# EAGLE design 2532 (EAGLE 9.6.2)
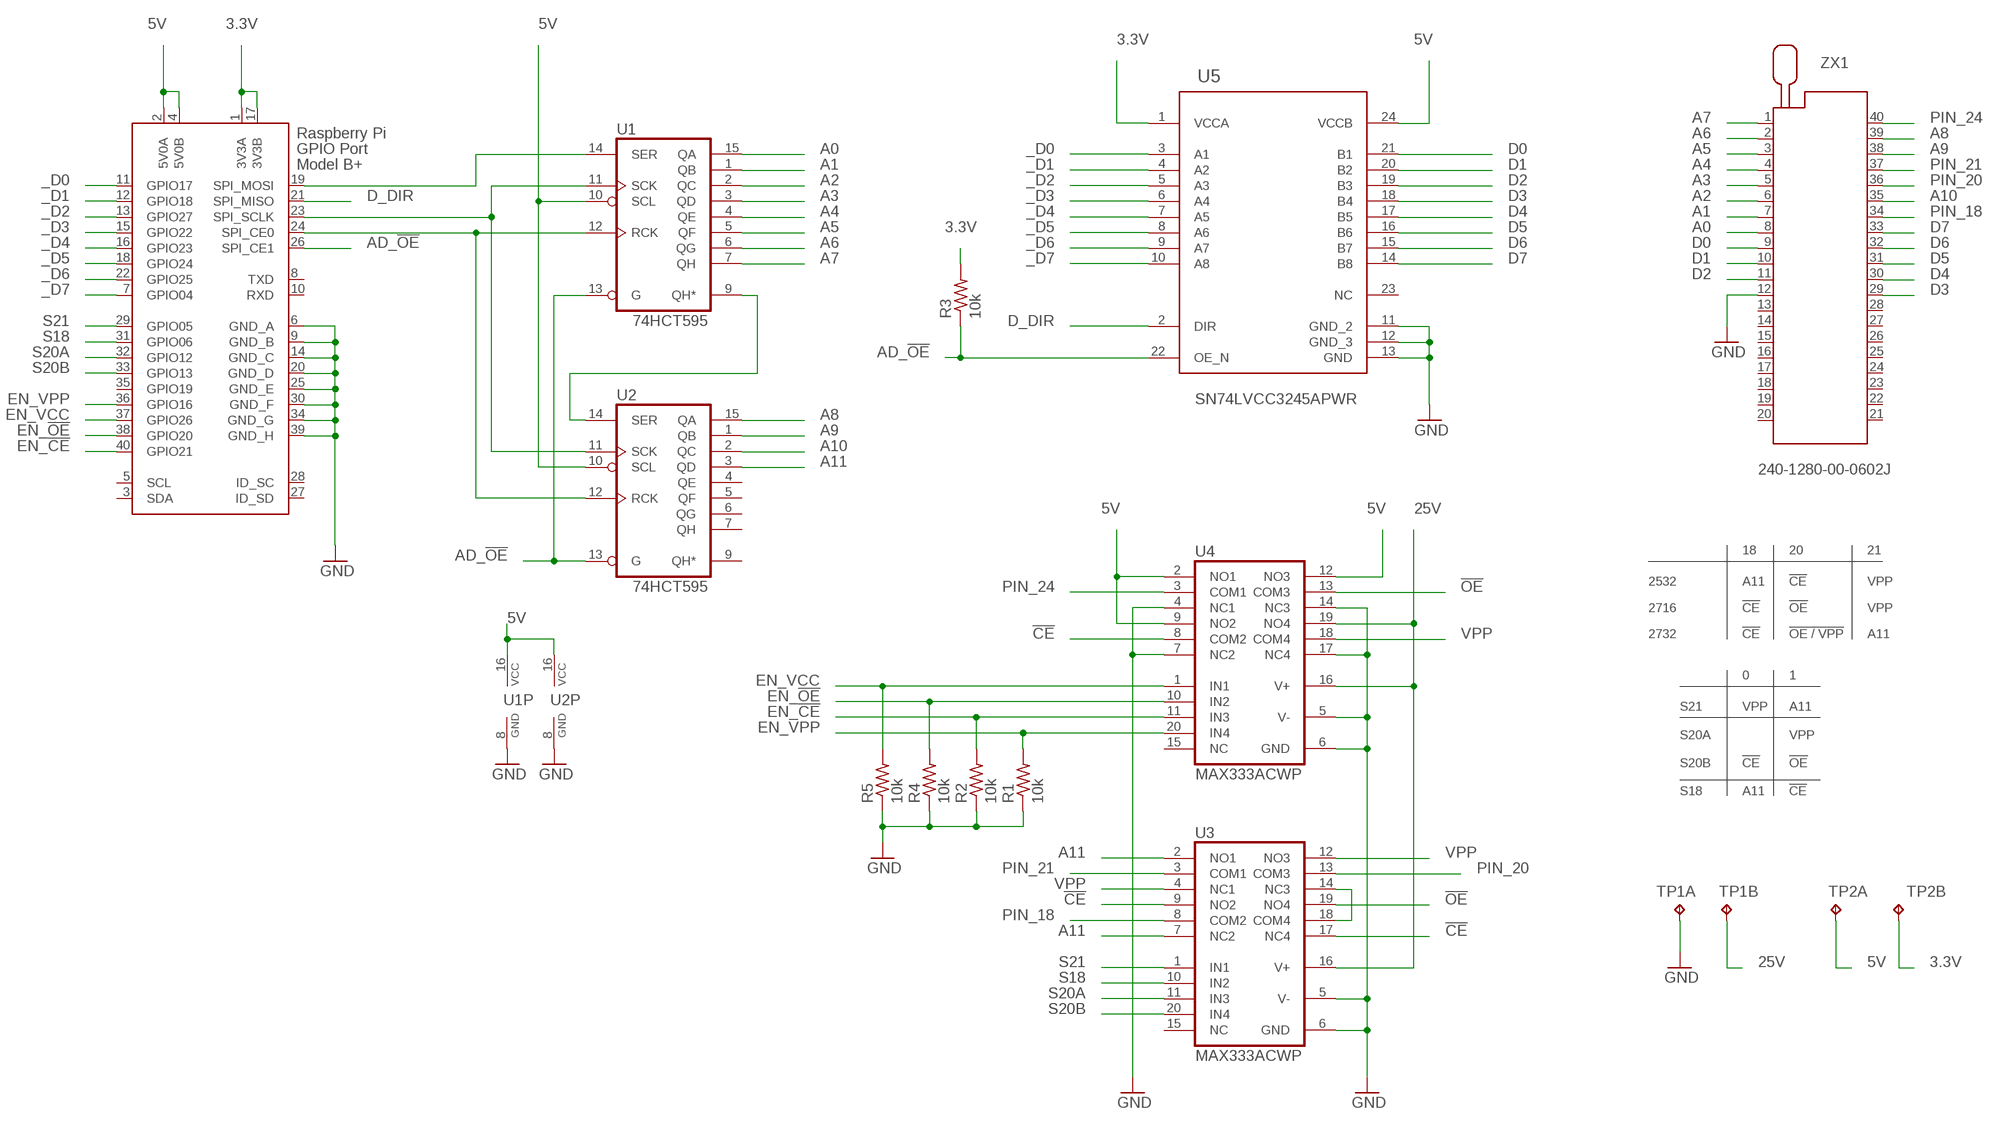
[diagram p0: schematic, sheet 1]

## Parts
R1  10k  R-US_R0603  [R0603]
R2  10k  R-US_R0603  [R0603]
R3  10k  R-US_R0603  [R0603]
R4  10k  R-US_R0603  [R0603]
R5  10k  R-US_R0603  [R0603]
TP1  TP2P2-38-17  [P2-38-17]
TP2  TP2P2-38-17  [P2-38-17]
U1  74HCT595  74HC595D  [SO16]
U2  74HCT595  74HC595D  [SO16]
U3  MAX333ACWP  [SO20L]
U4  MAX333ACWP  [SO20L]
U5  Value  SN74LVCC3245APWR  [PW0024A_N]
X2  RASPI_BOARD_B+#_E4P  [RASPI_BOARD_B+_EDGES_4DRILL_PAD]
ZX1  240-1280-00-0602J  [240-1280-00-0602J]

## Nets
3.3V [power]: R3.2 TP2.TP-2 U5.1(VCCA) X2.1(3V3A) X2.17(3V3B)
5V [power]: TP2.TP-1 U1.10(SCL) U1.16(VCC) U2.10(SCL) U2.16(VCC) U4.2(NO1) U4.9(NO2) U4.12(NO3) U5.24(VCCB) X2.2(5V0A) X2.4(5V0B)
25V [power]: TP1.TP-2 U3.16(V+) U4.16(V+) U4.19(NO4)
!CE: U3.9(NO2) U3.17(NC4) U4.8(COM2)
!OE: U3.19(NO4) U4.13(COM3)
_D0: U5.3(A1) X2.11(GPIO17)
_D1: U5.4(A2) X2.12(GPIO18)
_D2: U5.5(A3) X2.13(GPIO27)
_D3: U5.6(A4) X2.15(GPIO22)
_D4: U5.7(A5) X2.16(GPIO23)
_D5: U5.8(A6) X2.18(GPIO24)
_D6: U5.9(A7) X2.22(GPIO25)
_D7: U5.10(A8) X2.7(GPIO04)
A0: U1.15(QA) ZX1.8
A1: U1.1(QB) ZX1.7
A2: U1.2(QC) ZX1.6
A3: U1.3(QD) ZX1.5
A4: U1.4(QE) ZX1.4
A5: U1.5(QF) ZX1.3
A6: U1.6(QG) ZX1.2
A7: U1.7(QH) ZX1.1
A8: U2.15(QA) ZX1.39
A9: U2.1(QB) ZX1.38
A10: U2.2(QC) ZX1.35
A11: U2.3(QD) U3.2(NO1) U3.7(NC2)
AD_!OE: R3.1 U1.13(G) U2.13(G) U5.22(OE_N) X2.26(SPI_CE1)
D0: U5.21(B1) ZX1.9
D1: U5.20(B2) ZX1.10
D2: U5.19(B3) ZX1.11
D3: U5.18(B4) ZX1.29
D4: U5.17(B5) ZX1.30
D5: U5.16(B6) ZX1.31
D6: U5.15(B7) ZX1.32
D7: U5.14(B8) ZX1.33
D_DIR: U5.2(DIR) X2.21(SPI_MISO)
EN_!CE: R2.2 U4.11(IN3) X2.40(GPIO21)
EN_!OE: R4.2 U4.10(IN2) X2.38(GPIO20)
EN_VCC: R5.2 U4.1(IN1) X2.37(GPIO26)
EN_VPP: R1.2 U4.20(IN4) X2.36(GPIO16)
GND: R1.1 R2.1 R4.1 R5.1 TP1.TP-1 U1.8(GND) U2.8(GND) U3.5(V-) U3.6(GND) U4.4(NC1) U4.5(V-) U4.6(GND) U4.7(NC2) U4.14(NC3) U4.17(NC4) U5.11(GND_2) U5.12(GND_3) U5.13(GND) X2.6(GND_A) X2.9(GND_B) X2.14(GND_C) X2.20(GND_D) X2.25(GND_E) X2.30(GND_F) X2.34(GND_G) X2.39(GND_H) ZX1.12
N$1: U3.14(NC3) U3.18(COM4)
N$2: U1.11(SCK) U2.11(SCK) X2.23(SPI_SCLK)
N$3: U1.12(RCK) U2.12(RCK) X2.24(SPI_CE0)
N$4: U1.9(QH*) U2.14(SER)
N$5: U1.14(SER) X2.19(SPI_MOSI)
PIN_18: U3.8(COM2) ZX1.34
PIN_20: U3.13(COM3) ZX1.36
PIN_21: U3.3(COM1) ZX1.37
PIN_24: U4.3(COM1) ZX1.40
S18: U3.10(IN2) X2.31(GPIO06)
S20A: U3.11(IN3) X2.32(GPIO12)
S20B: U3.20(IN4) X2.33(GPIO13)
S21: U3.1(IN1) X2.29(GPIO05)
VPP: U3.4(NC1) U3.12(NO3) U4.18(COM4)
Unconnected: U2.4(QE) U2.5(QF) U2.6(QG) U2.7(QH) U2.9(QH*) U3.15(NC) U4.15(NC) U5.23(NC) X2.3(SDA) X2.5(SCL) X2.8(TXD) X2.10(RXD) X2.27(ID_SD) X2.28(ID_SC) X2.35(GPIO19) ZX1.13 ZX1.14 ZX1.15 ZX1.16 ZX1.17 ZX1.18 ZX1.19 ZX1.20 ZX1.21 ZX1.22 ZX1.23 ZX1.24 ZX1.25 ZX1.26 ZX1.27 ZX1.28

## Notes on the sheet
- 18 | 20 | 21
- 2532
  
  2716
  
  2732
- A11
  
  !CE
  
  !CE
- !CE
  
  !OE
  
  !OE / VPP
- VPP
  
  VPP
  
  A11
- 0 | 1
- S21
  
  S20A
  
  S20B
  
  S18
- VPP
  
   
  
  !CE
  
  A11
- A11
  
  VPP
  
  !OE
  
  !CE

## Library data of the parts
R1-R5 = rcl:R-US_: RESISTOR, American symbol; SPICEPREFIX: R
TP1 TP2 = testpad:TP2: Test pad
U1 U2 = 74xx-eu:74*595: 8-bit SHIFT REGISTER, output latch
U3 U4 = maxim:MAX333ACWP: ANALOG SWITCH; MF: MAXIM; MPN: MAX333ACWP+; OC_FARNELL: 9725547; OC_NEWARK: 28K3302
U5 = SN74:SN74LVCC3245APWR; MANUFACTURER: Texas Instruments; PARTNUMBER: SN74LVCC3245APWR; REFDES: RefDes; TYPE: TYPE
X2 = raspberrypi_bastelstube_v13:RASPI_BOARD_B+#: Raspberry Pi GPIO connector with markings for the outer dimensions of the Raspberry Pi board model B+ with different sets of drill holes or mounting pads All pins connected
ZX1 = con-3m:240-?-00-0602J: Zero Insertion Force Socked Source: http://www.3M.com/ehpd

## Net classes
1 power: width 0.203 mm

## Board
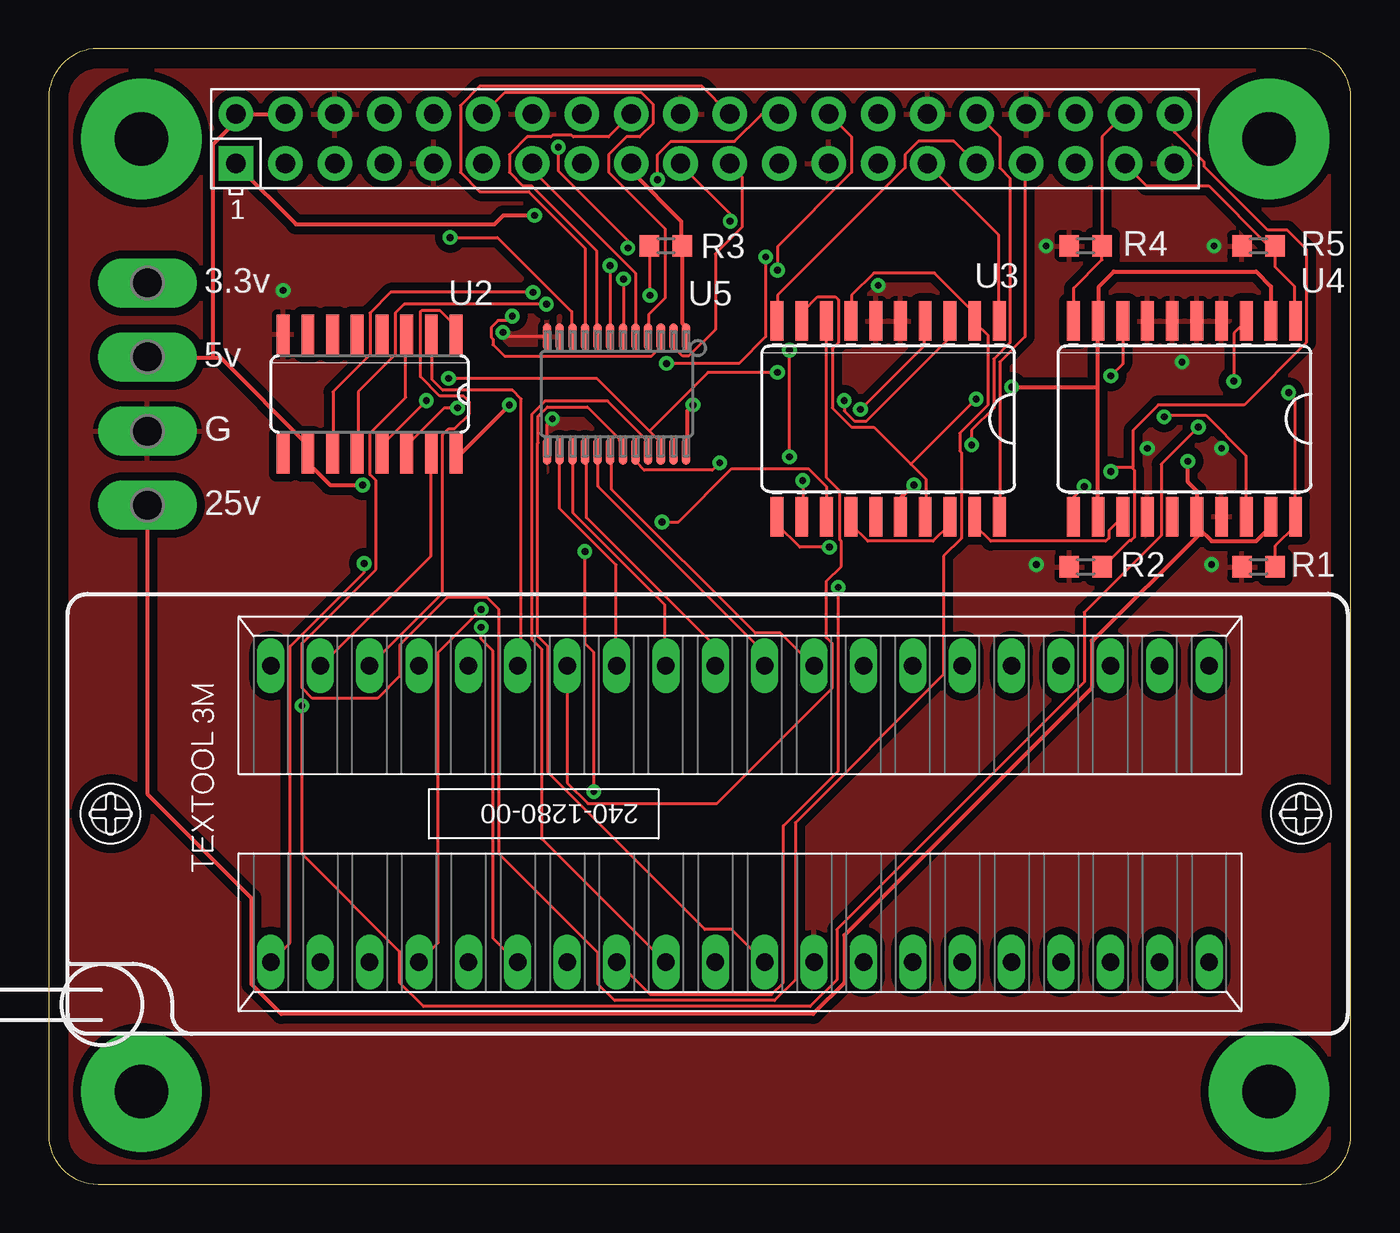
[diagram p1: board, top side]
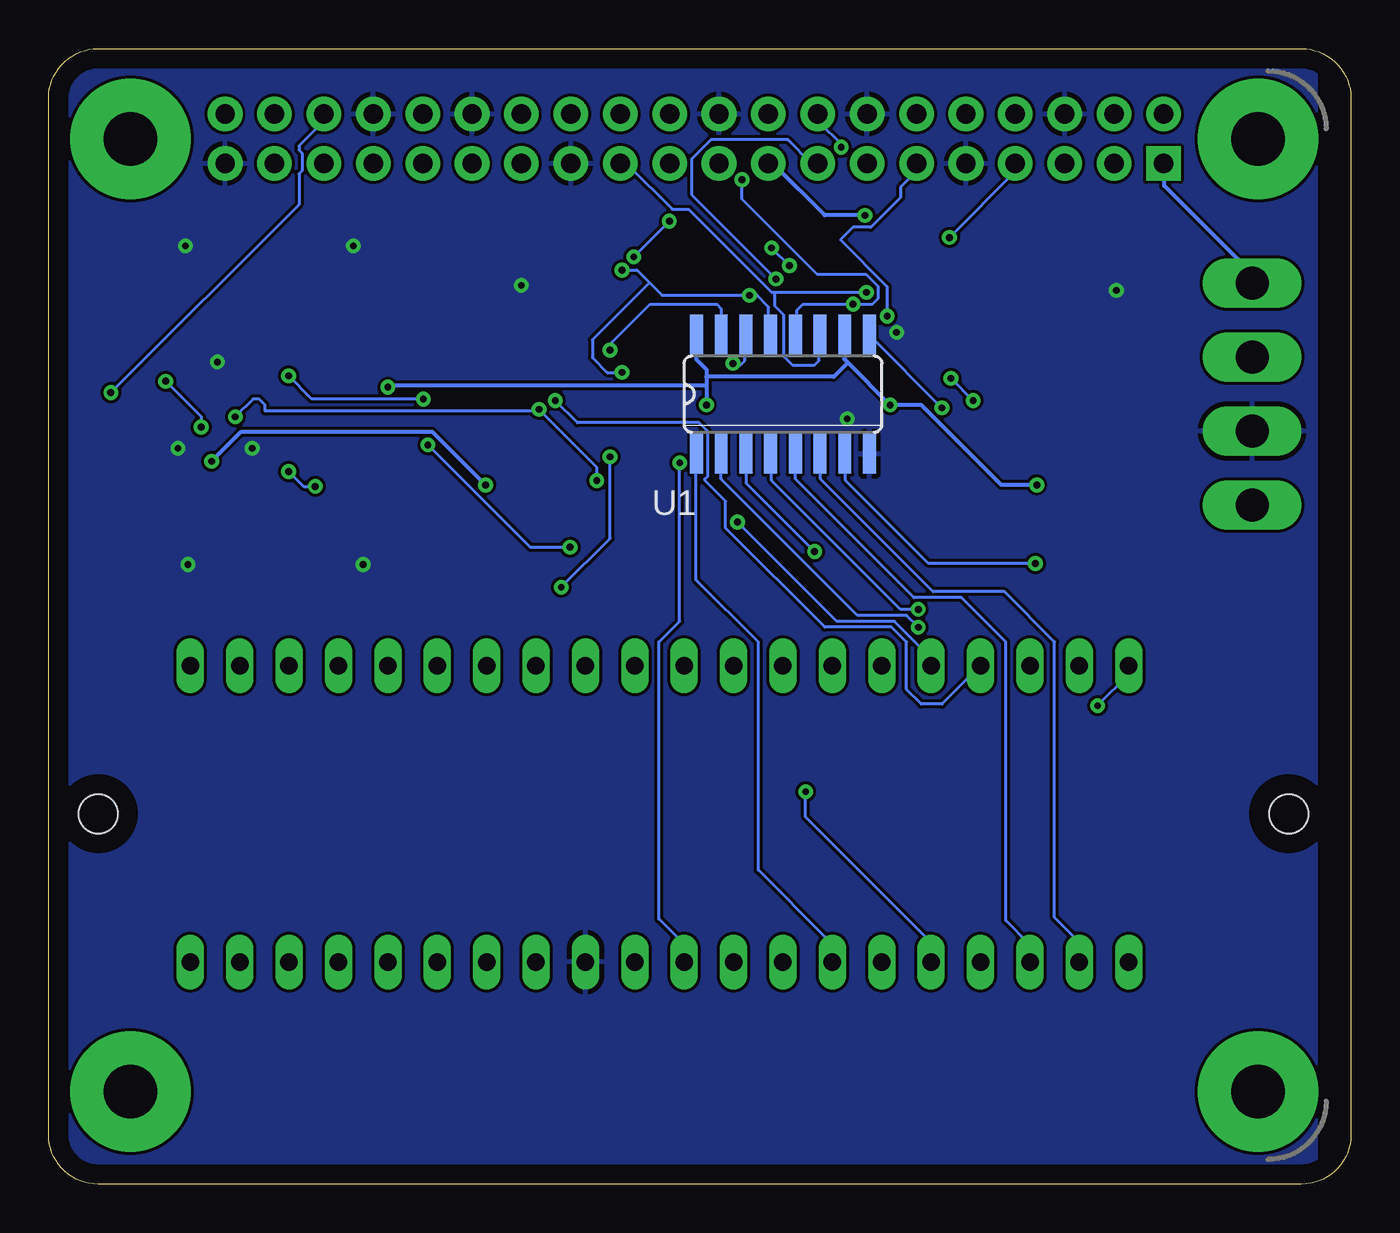
[diagram p2: board, bottom side, seen from below]

Size 66.98 x 58.41 mm. Coordinates in mm from the lower left corner, seen from the top.
Outline: 0,55.87 0,2.54 arc90 2.54,0 64.44,0 arc90 66.98,2.54 66.98,55.87 arc90 64.44,58.41 2.54,58.41 arc90 0,55.87
Copper layers (1*16): Top 0.035mm / dielectric 1.5mm / Bottom 0.035mm
Design rules "default": minimum track width 6mil, minimum drill 0.35mm, track to track 6mil, track to pad 6mil, pad to pad 6mil, via to via 6mil, smd to smd 6mil, copper to edge 40mil, drill to drill 6mil, minimum pad ring 10mil, minimum via ring 8mil, stop-mask expansion 4mil, vias tented up to drill 0mil, thermal gap 10mil

### Footprints (pad centres in the part's own frame; a part is rotated, then mirrored left to right if it is on the bottom)
R0603 = smd 1 x 1.1: 1 -0.85,0; 2 0.85,0
P2-38-17 = drill 1.702 pad 2.121 long: TP-1 -1.905,0; TP-2 1.905,0
SO16 = smd 0.66 x 2.032: 1 -4.445,-3.073; 2 -3.175,-3.073; 3 -1.905,-3.073; 4 -0.635,-3.073; 5 0.635,-3.073; 6 1.905,-3.073; 7 3.175,-3.073; 8 4.445,-3.073; 9 4.445,3.073; 10 3.175,3.073; 11 1.905,3.073; 12 0.635,3.073; 13 -0.635,3.073; 14 -1.905,3.073; 15 -3.175,3.073; 16 -4.445,3.073
SO20L = smd 0.66 x 2.032: 1 -5.715,-5.029; 2 -4.445,-5.029; 3 -3.175,-5.029; 4 -1.905,-5.029; 5 -0.635,-5.029; 6 0.635,-5.029; 7 1.905,-5.029; 8 3.175,-5.029; 9 4.445,-5.029; 10 5.715,-5.029; 11 5.715,5.029; 12 4.445,5.029; 13 3.175,5.029; 14 1.905,5.029; 15 0.635,5.029; 16 -0.635,5.029; 17 -1.905,5.029; 18 -3.175,5.029; 19 -4.445,5.029; 20 -5.715,5.029
PW0024A_N = smd 1.4 x 0.45: 1 -2.95,3.575; 2 -2.95,2.925; 3 -2.95,2.275; 4 -2.95,1.625; 5 -2.95,0.975; 6 -2.95,0.325; 7 -2.95,-0.325; 8 -2.95,-0.975; 9 -2.95,-1.625; 10 -2.95,-2.275; 11 -2.95,-2.925; 12 -2.95,-3.575; 13 2.95,-3.575; 14 2.95,-2.925; 15 2.95,-2.275; 16 2.95,-1.625; 17 2.95,-0.975; 18 2.95,-0.325; 19 2.95,0.325; 20 2.95,0.975; 21 2.95,1.625; 22 2.95,2.275; 23 2.95,2.925; 24 2.95,3.575
RASPI_BOARD_B+_EDGES_4DRILL_PAD = drill 1 pad 1.778 square: 1 8.37,51.23 | drill 1 pad 1.778: 2 8.37,53.77; 3 10.91,51.23; 4 10.91,53.77; 5 13.45,51.23; 6 13.45,53.77; 7 15.99,51.23; 8 15.99,53.77; 9 18.53,51.23; 10 18.53,53.77; 11 21.07,51.23; 12 21.07,53.77; 13 23.61,51.23; 14 23.61,53.77; 15 26.15,51.23; 16 26.15,53.77; 17 28.69,51.23; 18 28.69,53.77; 19 31.23,51.23; 20 31.23,53.77; 21 33.77,51.23; 22 33.77,53.77; 23 36.31,51.23; 24 36.31,53.77; 25 38.85,51.23; 26 38.85,53.77; 27 41.39,51.23; 28 41.39,53.77; 29 43.93,51.23; 30 43.93,53.77; 31 46.47,51.23; 32 46.47,53.77; 33 49.01,51.23; 34 49.01,53.77; 35 51.55,51.23; 36 51.55,53.77; 37 54.09,51.23; 38 54.09,53.77; 39 56.63,51.23; 40 56.63,53.77 | drill 2.75 pad 6.2: 41 3.5,3.5; 42 61.5,3.5; 43 61.5,52.5; 44 3.5,52.5
240-1280-00-0602J = drill 0.9 long: 1 -24.13,-7.62; 2 -21.59,-7.62; 3 -19.05,-7.62; 4 -16.51,-7.62; 5 -13.97,-7.62; 6 -11.43,-7.62; 7 -8.89,-7.62; 8 -6.35,-7.62; 9 -3.81,-7.62; 10 -1.27,-7.62; 11 1.27,-7.62; 12 3.81,-7.62; 13 6.35,-7.62; 14 8.89,-7.62; 15 11.43,-7.62; 16 13.97,-7.62; 17 16.51,-7.62; 18 19.05,-7.62; 19 21.59,-7.62; 20 24.13,-7.62; 21 24.13,7.62; 22 21.59,7.62; 23 19.05,7.62; 24 16.51,7.62; 25 13.97,7.62; 26 11.43,7.62; 27 8.89,7.62; 28 6.35,7.62; 29 3.81,7.62; 30 1.27,7.62; 31 -1.27,7.62; 32 -3.81,7.62; 33 -6.35,7.62; 34 -8.89,7.62; 35 -11.43,7.62; 36 -13.97,7.62; 37 -16.51,7.62; 38 -19.05,7.62; 39 -21.59,7.62; 40 -24.13,7.62 | hole 2: 28.86,0; -32.36,0

### Placement (x,y rotation side)
R1  62.23,31.75 0 top
R2  53.34,31.75 0 top
R3  31.75,48.26 0 top
R4  53.34,48.26 0 top
R5  62.23,48.26 0 top
TP1  5.08,36.83 270 top
TP2  5.08,44.45 90 top
U1  29.21,40.64 0 bottom
U2  16.51,40.64 180 top
U3  43.18,39.37 180 top
U4  58.42,39.37 180 top
U5  29.21,40.64 270 top
X2  1.27,1.27 0 top
ZX1  35.56,19.05 0 top

### Tracks (layer width: path | path; a pad name or v marks a point on that pad's centre or on a via)
3.3V  (via drill 0.35)
  Top 0.203: v24.99,49.84 23.39,49.84 22.94,49.38 12.72,49.38 9.68,52.43 X2.1 | U5.1 32.77,43.66 32.77,44.12 32.61,44.27 32.61,48.23 R3.2 32.54,48.31 32.54,49.53 30.02,52.05 30.02,52.44 X2.17
  Bottom 0.203: X2.1 9.6,52.43 9.6,51.36 5.11,46.86 5.11,46.41 TP2.TP-2 | v24.99,49.84 27.05,49.84 29.64,52.43 29.95,52.43 X2.17
5V  (via drill 0.35)
  Top 0.203: 53.95,41 53.95,44.37 U4.9 54.03,44.45 54.03,46.18 54.79,46.94 62.1,46.94 62.87,46.18 U4.2 | 53.95,41 53.95,34.39 54.03,34.37 U4.12 | v33.15,40.08 32.84,39.78 32.84,37.72 U5.24 | U2.16 21.18,37.57 v23.7,40.08 | X2.4 12.12,55.02 9.68,55.02 X2.2 9.68,54.94 9.68,54.71 8.46,53.49 8.46,42.52 | 8.46,42.52 5.11,42.52 TP2.TP-1 | 8.46,42.52 8.84,42.52 13.34,38.02 U2.10 13.34,37.11 14.48,35.97 v16.15,35.97 | v49.53,41 53.95,41
  Bottom 0.203: 33.15,41.53 33.15,41.91 33.68,42.44 33.68,43.66 U1.16 | 33.15,41.53 33.15,41.07 | 33.15,41.07 v33.15,40.08 | 25.87,42.25 26.06,42.44 26.06,43.66 U1.10 | 25.87,42.25 v23.7,40.08 22.1,40.08 17.98,35.97 v16.15,35.97 | 33.15,41.53 26.59,41.53 25.87,42.25 | v49.53,41 49.45,41.07 33.15,41.07
25V  (via drill 0.35)
  Top 0.203: U3.16 43.81,35.28 v44.5,35.97 | v58.6,37.19 58.6,36.12 59.05,35.66 U4.16 | TP1.TP-2 5.11,34.9 5.11,20.04 10.44,14.71 10.44,10.29 11.96,8.76 39.32,8.76 40.92,10.36 40.92,12.8 53.65,25.53 53.65,27.96 53.72,27.96 59.28,33.53 U4.16 | U4.19 62.87,33.83 62.1,33.07 59.82,33.07 59.13,33.76 59.13,34.29 U4.16
  Bottom 0.203: v44.5,35.97 47.24,38.71 57.07,38.71 v58.6,37.19
!CE  (via drill 0.35)
  Top 0.152: 44.35,37.03 42.44,38.94 41.3,38.94 40.31,39.93 40.31,42.98 40.62,43.28 40.62,45.49 40.46,45.64 39.55,45.64 38.79,44.88 38.79,44.42 U3.9 | 44.35,37.03 45.11,36.27 45.11,34.37 U3.17 | U4.8 55.24,42.19 v54.63,41.58 | 44.35,37.03 v47.7,40.39
  Bottom 0.152: v54.63,41.58 53.44,40.39 v47.7,40.39
!OE
  Top 0.152: U3.19 47.62,33.91 48.46,33.07 54.37,33.07 54.53,33.23 54.53,33.63 U4.13
_D0  (via drill 0.35)
  Top 0.152: U5.3 31.47,43.05 31.01,42.6 23.44,42.6 22.86,43.18 22.86,43.47 22.76,43.56 22.76,44.07 23.12,44.42 23.62,44.42 v23.85,44.65
  Bottom 0.152: X2.11 22.4,52.43 22.4,52.05 23.16,51.28 23.16,50.75 24.69,49.23 25.6,49.23 26.25,48.58 23.85,46.18 v23.85,44.65
_D1
  Top 0.152: U5.4 30.86,43.66 30.86,44.73 31.7,45.57 31.7,49.15 28.8,52.05 28.8,52.96 29.72,53.87 30.4,53.87 31.09,54.56 31.09,55.55 30.48,56.16 23.47,56.16 22.4,55.09 X2.12
_D2
  Top 0.152: U5.5 30.18,43.66 30.18,46.86 24.92,52.12 24.92,52.43 X2.13
_D3  (via drill 0.35)
  Top 0.152: v29.57,46.56 29.57,43.66 U5.6
  Bottom 0.152: X2.15 27.43,52.5 27.74,52.5 28.96,53.72 32.92,53.72 33.91,52.73 33.91,50.9 v29.57,46.56
_D4  (via drill 0.35)
  Top 0.152: v28.88,47.24 28.88,43.66 U5.7 | v29.79,48.16 29.79,48.54 26.21,52.12 v26.21,53.34
  Bottom 0.152: v29.79,48.16 v28.88,47.24 | v26.21,53.34 26.21,53.49 27.36,54.63 27.36,55.02 X2.16
_D5
  Top 0.152: U5.8 28.19,43.66 28.19,48.01 24.84,51.36 24.38,51.36 23.7,52.05 23.7,52.96 24.61,53.87 25.83,53.87 25.91,53.95 26.9,53.95 26.98,53.87 28.8,53.87 29.95,55.02 X2.18
_D6
  Top 0.152: U5.9 27.58,43.66 27.58,48.16 24.69,51.05 22.17,51.05 21.18,52.05 21.18,55.47 22.17,56.46 33.6,56.46 34.98,55.09 X2.22
_D7  (via drill 0.35)
  Top 0.152: v20.65,48.69 23.09,48.69 26.9,44.88 26.9,43.66 U5.10
  Bottom 0.152: v20.65,48.69 17.3,52.05 17.3,52.43 X2.7
A0  (via drill 0.35)
  Top 0.152: v38.1,37.41 v38.1,42.9 | v40.62,30.71 40.62,21.26 37.8,18.44 37.8,10.36 37.19,9.75 30.94,9.75 29.26,11.43 ZX1.8
  Bottom 0.152: U1.15 32.38,45.03 32.61,45.26 36.04,45.26 38.1,43.2 v38.1,42.9 | v38.1,37.41 38.1,33.22 v40.62,30.71
A1
  Bottom 0.152: ZX1.7 26.98,11.73 26.98,12.65 30.48,16.15 30.48,27.89 33.68,31.09 33.68,37.57 U1.1
A2  (via drill 0.35)
  Top 0.152: v22.25,28.65 22.25,28.04 22.86,27.43 22.86,12.65 24.08,11.43 ZX1.6
  Bottom 0.152: U1.2 32.38,36.27 25.38,29.26 22.86,29.26 v22.25,28.65
A3  (via drill 0.35)
  Top 0.152: v27.58,32.54 27.58,27.81 28.04,27.36 v28.04,20.19
  Bottom 0.152: v27.58,32.54 31.09,36.04 31.09,37.57 U1.3 | v28.04,20.19 28.04,18.9 21.64,12.5 21.64,11.43 ZX1.5
A4  (via drill 0.35)
  Top 0.152: v22.25,29.57 20.04,27.36 20.04,12.42 ZX1.4
  Bottom 0.152: v22.25,29.57 23.16,29.57 29.79,36.2 29.79,37.57 U1.4
A5
  Bottom 0.152: U1.5 28.57,36.27 22.48,30.18 20.04,30.18 17.75,27.89 17.75,13.56 16.54,12.34 16.54,11.43 ZX1.3
A6
  Bottom 0.152: U1.6 27.28,37.57 27.28,36.27 21.49,30.48 17.83,30.48 15.24,27.89 15.24,13.72 14.02,12.5 14.02,11.43 ZX1.2
A7  (via drill 0.35)
  Top 0.152: v16.23,31.93 16.23,31.47 12.42,27.66 12.42,12.42 ZX1.1
  Bottom 0.152: v16.23,31.93 21.72,31.93 25.98,36.2 25.98,37.57 U1.7
A8
  Top 0.152: U2.15 19.66,37.57 19.66,32.31 14.02,26.67 ZX1.39
A9
  Top 0.152: U2.1 20.95,44.12 20.12,44.96 19.2,44.96 19.13,44.88 19.13,41.53 20.12,40.54 21.34,40.54 21.64,40.23 21.64,39.62 20.88,38.86 20.57,38.86 20.27,38.56 20.27,30.4 16.54,26.67 ZX1.38
A10
  Top 0.152: U2.2 19.74,43.66 19.74,41.38 20.27,40.84 23.85,40.84 24.31,40.39 24.31,26.82 24.16,26.67 ZX1.35
A11
  Top 0.152: U2.3 18.36,43.66 18.36,40.46 16.54,38.63 16.54,36.5 16.84,36.2 16.84,31.62 13.03,27.81 13.03,25.53 13.56,24.99 16.92,24.99 18.06,26.14 18.06,27.74 20.5,30.18 22.55,30.18 23.16,29.57 23.16,16.99 28.27,11.89 28.27,10.29 29.11,9.45 37.34,9.45 38.41,10.52 38.41,18.59 46.02,26.21 46.02,32.31 46.94,33.22 46.94,37.64 46.86,37.72 46.86,38.63 48.31,40.08 48.31,43.66 47.62,44.35 U3.2 47.62,44.81 45.57,46.86 42.44,46.86 41.3,45.72 41.3,44.42 U3.7
AD_!OE  (via drill 0.35)
  Top 0.152: v19.43,40.31 17.14,38.02 U2.13 | 30.9,38.75 28.19,41.45 v20.57,41.45 | 30.9,38.75 31.47,38.18 31.47,37.72 U5.22 | v30.94,45.72 30.94,48.23 R3.1 | v37.49,47.02 37.49,48.23 41.3,52.05 41.3,53.87 40.16,55.02 X2.26 | 30.9,38.75 33.91,41.76 v37.49,41.76
  Bottom 0.152: U1.13 29.95,43.81 29.95,45.11 30.56,45.72 v30.94,45.72 35.43,45.72 36.08,46.37 | v20.57,41.45 v19.43,40.31 | 36.08,46.37 36.73,47.02 v37.49,47.02 | v37.49,41.76 38.25,41.76 39.01,42.52 39.01,43.43 36.08,46.37
D0
  Top 0.152: U5.21 30.79,37.72 30.79,38.25 28.76,40.28 25.53,40.28 24.84,39.59 24.84,28.04 25.38,27.51 25.38,17.75 31.7,11.43 ZX1.9
D1  (via drill 0.35)
  Top 0.152: v34.52,37.11 34.14,36.73 30.63,36.73 30.25,37.11 30.25,37.64 U5.20
  Bottom 0.152: v34.52,37.11 34.52,28.96 35.59,27.89 35.59,13.64 34.59,12.65 34.59,11.73 ZX1.10
D2
  Top 0.152: U5.19 29.49,37.72 29.49,38.1 29.34,38.25 29.34,38.35 27.71,39.98 25.66,39.98 25.18,39.5 25.18,38.13 25.15,38.1 25.15,28.19 25.68,27.66 25.68,21.18 33.76,13.11 35.13,13.11 36.8,11.43 ZX1.11
D3
  Top 0.152: U5.18 28.96,37.64 28.96,35.74 36.35,28.35 37.64,28.35 39.32,26.67 ZX1.29
D4
  Top 0.152: U5.17 28.27,37.64 28.27,35.89 36.8,27.36 36.8,26.67 ZX1.30
D5
  Top 0.152: ZX1.31 34.29,27.66 27.66,34.29 27.66,37.64 U5.16
D6
  Top 0.152: U5.15 26.98,37.64 26.98,34.52 31.7,29.79 31.7,26.67 ZX1.32
D7
  Top 0.152: U5.14 26.29,37.64 26.29,34.75 29.18,31.85 29.18,26.67 ZX1.33
D_DIR
  Top 0.152: U5.2 32.16,43.59 32.16,43.05 32.61,42.6 32.92,42.6 34.29,43.97 34.29,47.85 35.66,49.23 35.66,51.82 35.05,52.43 X2.21
EN_!CE  (via drill 0.35)
  Top 0.152: 55.74,36.84 55.7,36.88 54.79,36.88 54.63,36.73 v54.63,36.65 | 55.74,36.84 55.85,36.73 55.85,33.28 55.67,33.1 55.58,33.1 54.25,31.77 R2.2 | X2.40 57.91,55.02 57.91,54.1 59.44,52.58 59.44,52.35 62.71,49.07 63.7,49.07 64.69,48.08 64.69,43.29 61.49,40.08 57.07,40.08 55.78,38.79 55.78,36.88 55.74,36.84 | v53.26,35.89 52.73,35.36 52.73,34.37 U4.11
  Bottom 0.152: v53.26,35.89 53.87,35.89 v54.63,36.65
EN_!OE
  Top 0.152: U4.10 52.73,44.45 52.73,46.1 54.18,47.55 54.18,48.23 R4.2 54.18,48.31 54.18,53.87 55.32,55.02 X2.38
EN_VCC
  Top 0.152: U4.1 64.08,44.45 64.08,46.18 63.09,47.17 63.09,48.23 R5.2 63.02,48.31 62.71,48.31 59.66,51.36 56.46,51.36 55.4,52.43 X2.37
EN_VPP  (via drill 0.35)
  Top 0.152: v63.78,40.72 64.08,40.41 64.08,34.39 U4.20 64.08,34.29 64.08,33.83 63.09,32.84 63.09,31.85
  Top 0.203: R1.2 63.08,31.84 63.09,31.85
  Bottom 0.152: v63.78,40.72 54.1,50.39 54.1,51.97 53.95,52.12 53.95,53.03 54.1,53.19 54.1,53.42 52.88,54.63 52.88,55.02 X2.36
GND  (via drill 0.35)
  Top 0.152: U5.12 23.59,43.59 v23.37,43.81 | U5.13 25.64,39.1 v25.91,39.37
  other vias: 42.67,46.23 51.31,48.26 59.94,48.26 58.29,42.29 59.82,31.88 60.33,37.85 50.8,31.88 12.06,45.97 56.52,37.85
  pour Top (isolate 0.406): 0,58.42 67.31,58.42 67.31,-1.27 0,-1.27
  pour Bottom: 1.75,58.42 67.31,58.42 67.31,1.27 66.04,0 1.75,0
N$1
  Top 0.152: U3.14 41.3,34.29 41.3,33.91 42.14,33.07 45.49,33.07 46.33,33.91 46.33,34.29 U3.18
N$2  (via drill 0.35)
  Top 0.152: v24.92,45.87 17.6,45.87 16.54,44.81 16.54,42.67 14.63,40.77 14.63,37.57 U2.11
  Bottom 0.152: 29.64,45.87 29.79,45.87 34.06,50.14 34.9,50.14 37.19,52.43 37.57,52.43 X2.23 | 29.64,45.87 v24.92,45.87 | 29.64,45.87 29.64,45.19 29.18,44.73 29.18,42.6 28.73,42.14 27.58,42.14 27.36,42.37 27.36,43.66 U1.11
N$3  (via drill 0.35)
  Top 0.152: v25.6,45.26 18.29,45.26 17.83,44.81 17.83,42.67 15.93,40.77 15.93,37.57 U2.12 | v31.32,51.66 31.32,52.96 32,53.65 35.28,53.65 36.65,55.02 37.57,55.02 X2.24
  Bottom 0.152: U1.12 28.57,43.74 28.5,43.81 28.5,44.96 28.19,45.26 v25.6,45.26 24.61,45.26 24.31,45.57 24.31,46.18 24.92,46.79 27.43,46.79 31.32,50.67 v31.32,51.66
N$4  (via drill 0.35)
  Top 0.152: v21.03,39.93 20.34,39.93 18.44,38.02 18.44,37.57 U2.14
  Bottom 0.152: v21.03,39.93 24.77,43.66 U1.9
N$5  (via drill 0.35)
  Top 0.152: v31.77,42.22 35.51,42.22 36.88,43.59 v36.88,47.7 | v35.05,49.53 35.05,49.91 32.54,52.43 X2.19
  Bottom 0.152: v31.77,42.22 31.7,42.14 31.39,42.14 31.17,42.37 31.17,43.66 U1.14 | v35.05,49.53 v36.88,47.7
PIN_18
  Top 0.152: U3.8 40.01,36.35 40.69,35.66 40.69,33.15 40.77,33.07 40.77,31.77 40.01,31.01 40.01,28.12 40.31,27.81 40.31,25.53 34.37,19.58 27.74,19.58 26.67,20.65 ZX1.34
PIN_20  (via drill 0.35)
  Top 0.152: U3.13 40.01,35.89 39.09,36.8 35.13,36.8 32.38,34.06 v31.55,34.06
  Bottom 0.152: v31.55,34.06 26.44,28.96 23.47,28.96 21.64,27.13 21.64,26.67 ZX1.36
PIN_21  (via drill 0.35)
  Top 0.152: v40.92,40.31 40.92,39.78 41.45,39.24 42.06,39.24 46.33,43.51 46.33,44.35 U3.3
  Bottom 0.152: v40.92,40.31 39.78,39.17 33.53,39.17 33.07,38.71 33.07,36.42 33.22,36.27 33.22,36.2 32.16,35.13 32.16,33.76 27.05,28.65 23.62,28.65 22.86,27.89 22.86,25.45 22.1,24.69 21.03,24.69 ZX1.37
PIN_24  (via drill 0.35)
  Top 0.152: v60.96,41.3 60.96,43.76 U4.3 | v13.03,24.61 13.03,16.99 18.06,11.96 18.06,10.36 19.28,9.14 39.17,9.14 40.54,10.52 40.54,13.11 53.26,25.83 53.26,29.41 57.23,33.38 57.23,37.03 v59.13,38.94
  Bottom 0.152: v13.03,24.61 11.43,26.21 ZX1.40 | v60.96,41.3 59.13,39.47 v59.13,38.94
S18
  Top 0.152: U3.10 37.49,44.42 37.49,45.72 44.04,52.27 44.04,52.96 44.73,53.65 46.56,53.65 47.7,52.5 X2.31
S20A  (via drill 0.35)
  Top 0.152: v40.16,32.77 38.63,32.77 37.49,33.91 37.49,34.29 U3.11 | v47.47,38.02 47.47,38.79 48.62,39.93 48.62,42.44 49.45,43.28 49.45,51.74 48.92,52.27 48.92,53.87 47.78,55.02 X2.32
  Bottom 0.152: v40.16,32.77 42.22,32.77 v47.47,38.02
S20B
  Top 0.152: U3.20 48.92,34.37 48.92,42.29 50.22,43.59 50.22,52.43 X2.33
S21
  Top 0.152: U3.1 48.84,44.42 48.84,48.84 45.26,52.43 X2.29
VPP  (via drill 0.35)
  Top 0.152: v38.79,36.2 38.79,34.37 U3.12 | v41.76,39.85 45.03,43.13 45.03,44.35 U3.4 | v57.38,39.47 57.45,39.55 59.51,39.55 61.57,37.49 61.57,34.39 U4.18
  Bottom 0.152: v38.79,36.2 38.79,36.88 v41.76,39.85 41.76,39.78 55.85,39.78 55.85,40.08 56.16,40.39 56.46,40.39 v57.38,39.47

### Text on the board
tNames: 3.3v | 5v | G | 25v